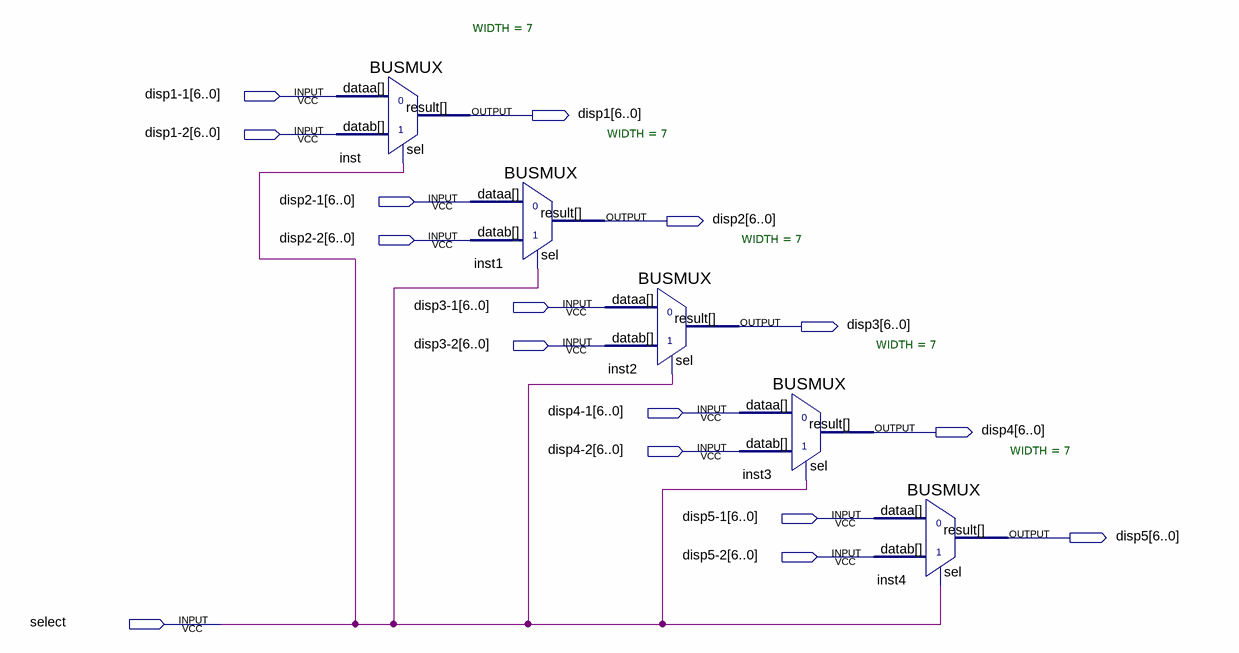
[diagram p0: schematic sheet]
// Quartus schematic 5parallelmuxarray.bdf as structural Verilog: 5 symbols, 16 pins
module \5parallelmuxarray  (
  input  [6:0] \disp1-1 ,
  input  [6:0] \disp1-2 ,
  input  [6:0] \disp2-1 ,
  input  [6:0] \disp2-2 ,
  input  [6:0] \disp3-1 ,
  input  [6:0] \disp3-2 ,
  input  [6:0] \disp4-1 ,
  input  [6:0] \disp4-2 ,
  input  [6:0] \disp5-1 ,
  input  [6:0] \disp5-2 ,
  input  select,
  output [6:0] disp1,
  output [6:0] disp2,
  output [6:0] disp3,
  output [6:0] disp4,
  output [6:0] disp5
);

  BUSMUX #(.WIDTH(7)) inst (.datab(\disp1-2 ), .sel(select), .dataa(\disp1-1 ), .result(disp1));
  BUSMUX #(.WIDTH(7)) inst1 (.datab(\disp2-2 ), .sel(select), .dataa(\disp2-1 ), .result(disp2));
  BUSMUX #(.WIDTH(7)) inst2 (.datab(\disp3-2 ), .sel(select), .dataa(\disp3-1 ), .result(disp3));
  BUSMUX #(.WIDTH(7)) inst3 (.datab(\disp4-2 ), .sel(select), .dataa(\disp4-1 ), .result(disp4));
  BUSMUX #(.WIDTH(7)) inst4 (.datab(\disp5-2 ), .sel(select), .dataa(\disp5-1 ), .result(disp5));
endmodule
